# Altium schematic sheet System Diagram.SchDoc
size A
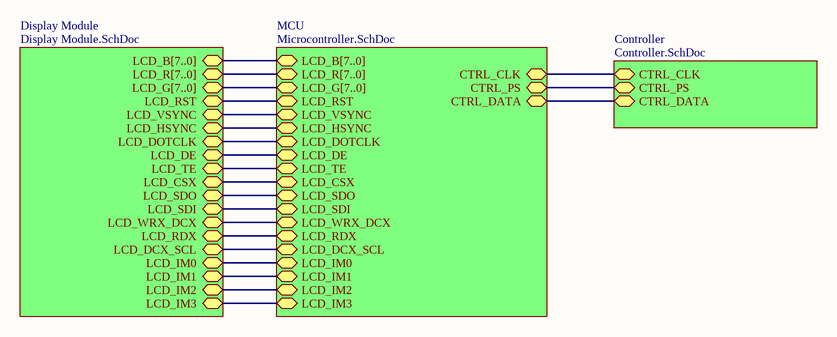
[diagram p0: System Diagram.SchDoc]

## Sub-sheets
Controller = Controller.SchDoc: CTRL_CLK (bidir), CTRL_PS (bidir), CTRL_DATA (bidir)
Display Module = Display Module.SchDoc: LCD_B[7..0] (bidir), LCD_R[7..0] (bidir), LCD_G[7..0] (bidir), LCD_RST (bidir), LCD_VSYNC (bidir), LCD_HSYNC (bidir), LCD_DOTCLK (bidir), LCD_DE (bidir), LCD_TE (bidir), LCD_CSX (bidir), LCD_SDO (bidir), LCD_SDI (bidir), LCD_WRX_DCX (bidir), LCD_RDX (bidir), LCD_DCX_SCL (bidir), LCD_IM0 (bidir), LCD_IM1 (bidir), LCD_IM2 (bidir), LCD_IM3 (bidir)
MCU = Microcontroller.SchDoc: LCD_B[7..0] (bidir), LCD_R[7..0] (bidir), LCD_G[7..0] (bidir), LCD_RST (bidir), LCD_VSYNC (bidir), LCD_HSYNC (bidir), LCD_DOTCLK (bidir), LCD_DE (bidir), LCD_TE (bidir), LCD_CSX (bidir), LCD_SDO (bidir), LCD_SDI (bidir), LCD_WRX_DCX (bidir), LCD_RDX (bidir), LCD_DCX_SCL (bidir), LCD_IM0 (bidir), LCD_IM1 (bidir), LCD_IM2 (bidir), LCD_IM3 (bidir), CTRL_PS (bidir), CTRL_CLK (bidir), CTRL_DATA (bidir)

## Nets
(unnamed): sheet MCU/LCD_RST, sheet Display Module/LCD_RST
(unnamed): sheet MCU/LCD_VSYNC, sheet Display Module/LCD_VSYNC
(unnamed): sheet MCU/LCD_HSYNC, sheet Display Module/LCD_HSYNC
(unnamed): sheet MCU/LCD_DOTCLK, sheet Display Module/LCD_DOTCLK
(unnamed): sheet MCU/LCD_DE, sheet Display Module/LCD_DE
(unnamed): sheet MCU/LCD_TE, sheet Display Module/LCD_TE
(unnamed): sheet MCU/LCD_CSX, sheet Display Module/LCD_CSX
(unnamed): sheet MCU/LCD_SDO, sheet Display Module/LCD_SDO
(unnamed): sheet MCU/LCD_SDI, sheet Display Module/LCD_SDI
(unnamed): sheet MCU/LCD_WRX_DCX, sheet Display Module/LCD_WRX_DCX
(unnamed): sheet MCU/LCD_RDX, sheet Display Module/LCD_RDX
(unnamed): sheet MCU/LCD_DCX_SCL, sheet Display Module/LCD_DCX_SCL
(unnamed): sheet MCU/LCD_IM0, sheet Display Module/LCD_IM0
(unnamed): sheet MCU/LCD_IM1, sheet Display Module/LCD_IM1
(unnamed): sheet MCU/LCD_IM2, sheet Display Module/LCD_IM2
(unnamed): sheet MCU/LCD_IM3, sheet Display Module/LCD_IM3
(unnamed): sheet MCU/CTRL_PS, sheet Controller/CTRL_PS
(unnamed): sheet MCU/CTRL_CLK, sheet Controller/CTRL_CLK
(unnamed): sheet MCU/CTRL_DATA, sheet Controller/CTRL_DATA

## Buses and harness runs
bus sheet Display Module/LCD_B[7..0] = sheet MCU/LCD_B[7..0]
bus sheet Display Module/LCD_G[7..0] = sheet MCU/LCD_G[7..0]
bus sheet Display Module/LCD_R[7..0] = sheet MCU/LCD_R[7..0]